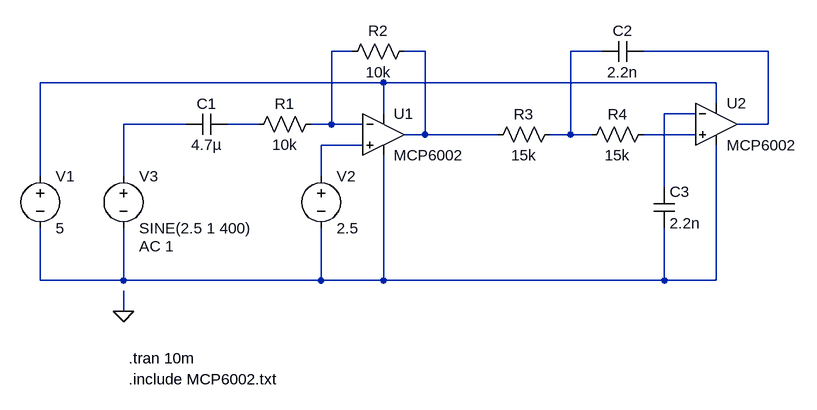
[diagram p0: schematic MCP6001.asc]
MCP6001.asc, the LTspice schematic file:
Version 4.1
SHEET 1 880 680
WIRE 144 32 112 32
WIRE 256 32 224 32
WIRE 528 32 480 32
WIRE 784 32 592 32
WIRE 192 80 -336 80
WIRE 704 80 192 80
WIRE 704 112 704 80
WIRE 192 128 192 80
WIRE 672 128 624 128
WIRE -112 144 -208 144
WIRE 0 144 -48 144
WIRE 112 144 112 32
WIRE 112 144 80 144
WIRE 160 144 112 144
WIRE 784 144 784 32
WIRE 784 144 736 144
WIRE 256 160 256 32
WIRE 256 160 224 160
WIRE 368 160 256 160
WIRE 480 160 480 32
WIRE 480 160 448 160
WIRE 512 160 480 160
WIRE 672 160 592 160
WIRE 160 176 96 176
WIRE -336 224 -336 80
WIRE -208 224 -208 144
WIRE 96 224 96 176
WIRE 624 240 624 128
WIRE -336 384 -336 304
WIRE -208 384 -208 304
WIRE -208 384 -336 384
WIRE 96 384 96 304
WIRE 96 384 -208 384
WIRE 192 384 192 192
WIRE 192 384 96 384
WIRE 624 384 624 304
WIRE 624 384 192 384
WIRE 704 384 704 176
WIRE 704 384 624 384
WIRE -208 432 -208 400
FLAG -208 432 0
SYMBOL res 96 128 R90
WINDOW 0 0 56 VBottom 2
WINDOW 3 32 56 VTop 2
SYMATTR InstName R1
SYMATTR Value 10k
SYMBOL res 240 16 R90
WINDOW 0 0 56 VBottom 2
WINDOW 3 32 56 VTop 2
SYMATTR InstName R2
SYMATTR Value 10k
SYMBOL cap -48 128 R90
WINDOW 0 0 32 VBottom 2
WINDOW 3 32 32 VTop 2
SYMATTR InstName C1
SYMATTR Value 4.7µ
SYMBOL cap 592 16 R90
WINDOW 0 0 32 VBottom 2
WINDOW 3 32 32 VTop 2
SYMATTR InstName C2
SYMATTR Value 2.2n
SYMBOL cap 608 240 R0
SYMATTR InstName C3
SYMATTR Value 2.2n
SYMBOL voltage -336 208 R0
WINDOW 123 0 0 Left 0
WINDOW 39 0 0 Left 0
SYMATTR InstName V1
SYMATTR Value 5
SYMBOL voltage 96 208 R0
WINDOW 123 0 0 Left 0
WINDOW 39 0 0 Left 0
SYMATTR InstName V2
SYMATTR Value 2.5
SYMBOL voltage -208 208 R0
WINDOW 123 24 124 Left 2
WINDOW 39 0 0 Left 0
SYMATTR InstName V3
SYMATTR Value SINE(2.5 1 400)
SYMATTR Value2 AC 1
SYMBOL OpAmps\\opamp2 192 96 R0
SYMATTR InstName U1
SYMATTR Value MCP6002
SYMBOL OpAmps\\opamp2 704 80 R0
SYMATTR InstName U2
SYMATTR Value MCP6002
SYMBOL res 464 144 R90
WINDOW 0 0 56 VBottom 2
WINDOW 3 32 56 VTop 2
SYMATTR InstName R3
SYMATTR Value 15k
SYMBOL res 608 144 R90
WINDOW 0 0 56 VBottom 2
WINDOW 3 32 56 VTop 2
SYMATTR InstName R4
SYMATTR Value 15k
TEXT -200 536 Left 2 !.include MCP6002.txt
TEXT -200 504 Left 2 !.tran 10m

The netlist it stands for:
* MCP6001.asc
R1 N001 N008 10k
R2 N002 N001 10k
C1 N008 N007 4.7µ
C2 N004 N003 2.2n
C3 N006 N011 2.2n
V1 N005 N011 5
V2 N010 N011 2.5
V3 N007 N011 SINE(2.5 1 400) AC 1
X§U1 N010 N001 N005 N011 N002 MCP6002  ; pins In+ In- V+ V- OUT
X§U2 N009 N006 N005 N011 N004 MCP6002  ; pins In+ In- V+ V- OUT
R3 N003 N002 15k
R4 N009 N003 15k
.include MCP6002.txt
.tran 10m
.backanno
.end